# EAGLE design Level-Shifter-74244_v10 (EAGLE 7.7.0)
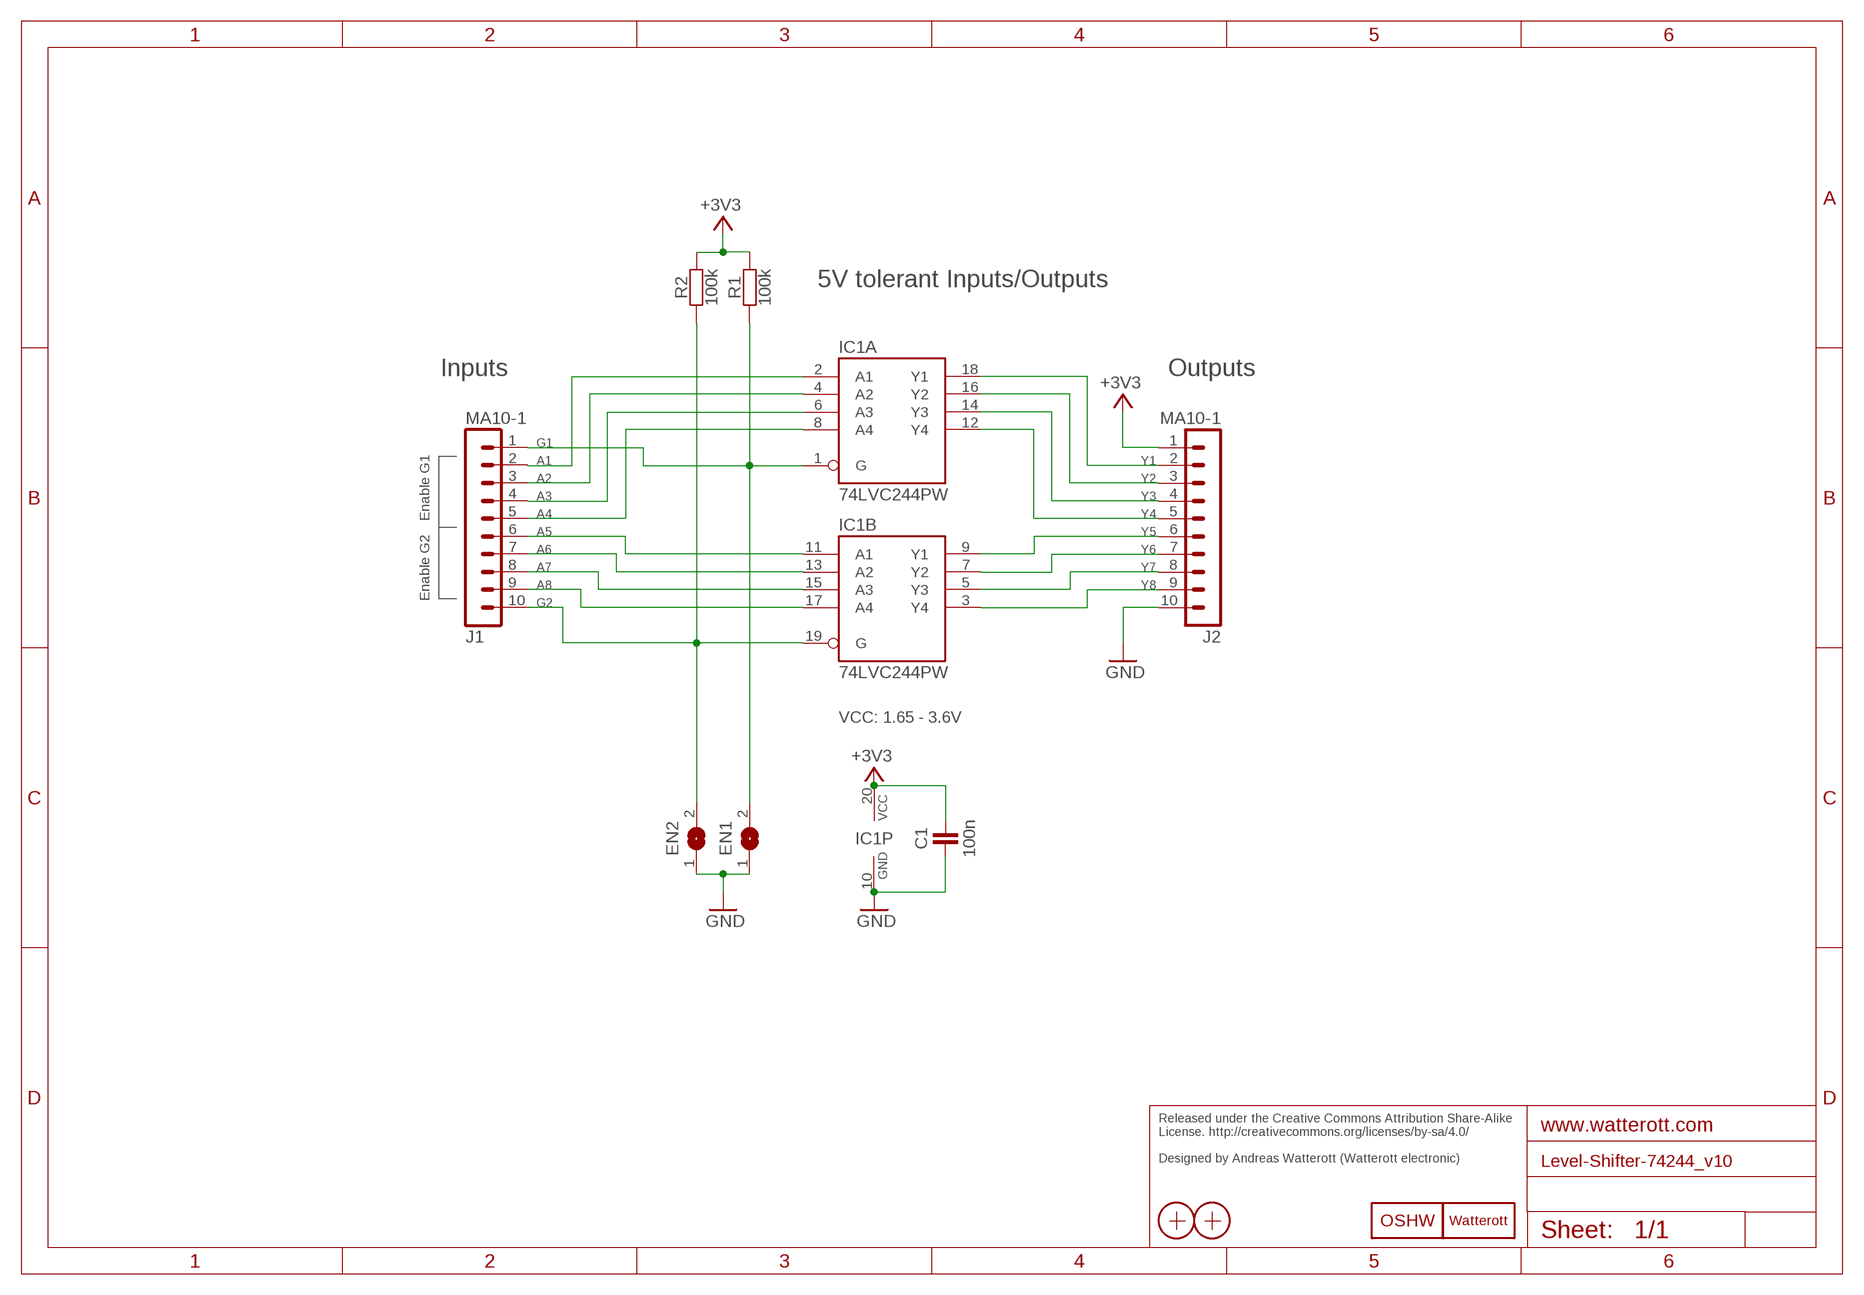
[diagram p0: schematic, sheet 1]

## Parts
C1  100n  CAPACITOR-0402  [C0402]
EN1  JUMPER2-0603-NC  [JUMPER2-0603_NC]
EN2  JUMPER2-0603-NC  [JUMPER2-0603_NC]
IC1  74LVC244PW  [TSSOP20]
J1  MA10-1  [MA10-1]
J2  MA10-1  [MA10-1]
LOGO1  OSHW_LOGOX0070  [OSHW_6X70]
LOGO2  LOGO-S_PLACE_S  [SPARK_TPLACE_S]
R1  100k  RESISTOR-0402  [C0402]
R2  100k  RESISTOR-0402  [C0402]
X1  PASSER-07  [PASSER_07MM]
X2  PASSER-07  [PASSER_07MM]

## Nets
+3V3: C1.2 IC1.20(P:VCC) J2.1 R1.2 R2.2
A1: IC1.2(A:A1) J1.2
A2: IC1.4(A:A2) J1.3
A3: IC1.6(A:A3) J1.4
A4: IC1.8(A:A4) J1.5
A5: IC1.11(B:A1) J1.6
A6: IC1.13(B:A2) J1.7
A7: IC1.15(B:A3) J1.8
A8: IC1.17(B:A4) J1.9
G1: EN1.2 IC1.1(A:G) J1.1 R1.1
G2: EN2.2 IC1.19(B:G) J1.10 R2.1
GND: C1.1 EN1.1 EN2.1 IC1.10(P:GND) J2.10
Y1: IC1.18(A:Y1) J2.2
Y2: IC1.16(A:Y2) J2.3
Y3: IC1.14(A:Y3) J2.4
Y4: IC1.12(A:Y4) J2.5
Y5: IC1.9(B:Y1) J2.6
Y6: IC1.7(B:Y2) J2.7
Y7: IC1.5(B:Y3) J2.8
Y8: IC1.3(B:Y4) J2.9

## Notes on the sheet
- 5V tolerant Inputs/Outputs
- Inputs | Outputs
- Enable G1
- Enable G2
- VCC: 1.65 - 3.6V
- Released under the Creative Commons Attribution Share-Alike 
  License. http://creativecommons.org/licenses/by-sa/4.0/
  
  Designed by Andreas Watterott (Watterott electronic)

## Library data of the parts
C1 = we-rcl:CAPACITOR: Capacitors ...2.2uF @ 6.3V -> 0402 ...4.7uF @ 6.3V -> 0603 ...10uF @ 16V -> 0805 ...22uF @ 25V -> 1206
EN1 EN2 = we-rcl:JUMPER2: 2 Pin Jumpers
IC1 = we-chip:74*244: 74x244 Octal Buffer and Line Driver (3-State); DIGIKEY: 568-1583-2-ND
J1 J2 = we-con:MA10-1: Pin Header
LOGO1 = we-symbol:OSHW_LOGO: Open-Source-Hardware Logo
LOGO2 = we-symbol:LOGO: Watterott electronic Logo
R1 R2 = we-rcl:RESISTOR: Resistors all kinds in 0402 and 0603
X1 X2 = we-symbol:PASSER: Fiducial Markers

## Board
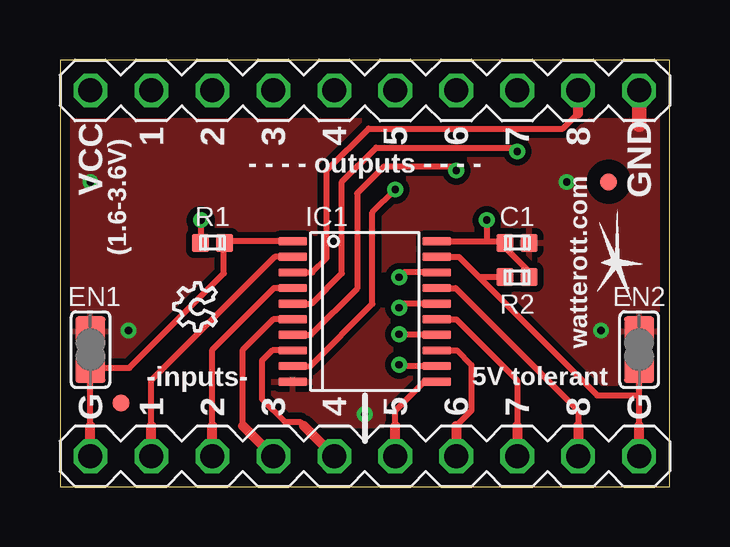
[diagram p1: board, top side]
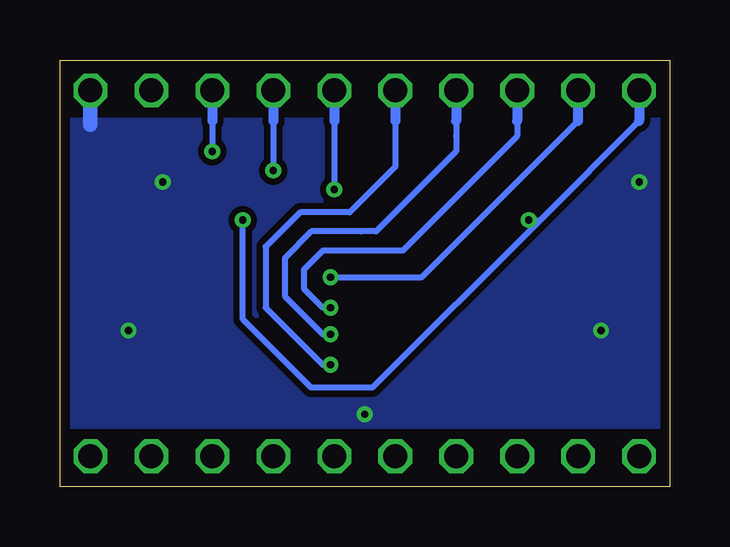
[diagram p2: board, bottom side, seen from below]

Size 25.4 x 17.78 mm. Coordinates in mm from the lower left corner, seen from the top.
Outline: 0,0 25.4,0 25.4,17.78 0,17.78 0,0
Copper layers (1*16): Top 0.035mm / dielectric 1.5mm / Bottom 0.035mm
Design rules "we-dru-2-layer *": minimum track width 0.15mm, minimum drill 0.3mm, track to track 0.15mm, track to pad 0.15mm, pad to pad 0.15mm, via to via 0.15mm, smd to smd 0.1mm, copper to edge 0.4mm, drill to drill 0.2mm, minimum pad ring 0.18mm, minimum via ring 0.18mm, stop-mask expansion 0.1mm, vias tented up to drill 0.5mm, thermal gap 0.25mm

### Footprints (pad centres in the part's own frame; a part is rotated, then mirrored left to right if it is on the bottom)
C0402 = smd 0.75 x 0.7: 1 0,0.5; 2 0,-0.5
JUMPER2-0603_NC = smd 1.25 x 1.25: 1 0,0.76; 2 0,-0.76
TSSOP20 = smd 1.2 x 0.35: 1 -3,2.925; 2 -3,2.275; 3 -3,1.625; 4 -3,0.975; 5 -3,0.325; 6 -3,-0.325; 7 -3,-0.975; 8 -3,-1.625; 9 -3,-2.275; 10 -3,-2.925; 11 3,-2.925; 12 3,-2.275; 13 3,-1.625; 14 3,-0.975; 15 3,-0.325; 16 3,0.325; 17 3,0.975; 18 3,1.625; 19 3,2.275; 20 3,2.925
MA10-1 = drill 1 octagon: 1 0,11.43; 2 0,8.89; 3 0,6.35; 4 0,3.81; 5 0,1.27; 6 0,-1.27; 7 0,-3.81; 8 0,-6.35; 9 0,-8.89; 10 0,-11.43
PASSER_07MM = smd 0.7 x 0.7: X 0,0

### Placement (x,y rotation side)
C1  19.05,10.16 270 top
EN1  1.27,5.71 0 top
EN2  24.13,5.71 0 top
IC1  12.7,7.3 0 top
J1  12.7,1.27 90 top
J2  12.7,16.51 90 top
LOGO1  6.51,6.51 90 top
LOGO2  23.18,9.37 90 top
R1  6.35,10.16 270 top
R2  19.05,8.73 90 top
X1  2.54,3.49 0 top
X2  22.86,12.7 0 top

### Tracks (layer width: path | path; a pad name or v marks a point on that pad's centre or on a via)
+3V3  (via drill 0.3)
  Top 0.254: IC1.20 17.78,10.23 | 17.78,10.23 18.48,10.23 C1.2 18.55,9.96 19.55,8.96 R2.2 | v17.78,11.11 17.78,10.23 | v5.87,11.11 5.87,10.18 R1.2
  Bottom 0.254: 1.27,15.24 5.4,11.11 | 5.4,11.11 12.38,4.13 14.92,4.13 17.78,6.99 v17.78,11.11 | v5.87,11.11 5.4,11.11
  Bottom 0.406: J2.1 1.27,15.24
A1
  Top 0.254: 3.81,2.54 3.81,4.45 8.94,9.58 IC1.2
  Top 0.406: J1.2 3.81,2.54
A2
  Top 0.254: 6.35,2.54 6.35,5.71 8.91,8.28 IC1.4
  Top 0.406: J1.3 6.35,2.54
A3
  Top 0.254: 7.62,2.54 7.62,5.71 8.88,6.98 IC1.6
  Top 0.406: J1.4 7.62,2.54
A4
  Top 0.254: IC1.8 8.85,5.68 8.41,5.24 8.41,3.65 9.37,2.7 10,2.7 10.16,2.54
  Top 0.406: 10.16,2.54 J1.5
A5
  Top 0.254: 13.97,2.54 13.97,3.17 15.17,4.38 IC1.11
  Top 0.406: J1.6 13.97,2.54
A6
  Top 0.254: IC1.13 16.55,5.68 17.14,5.08 17.14,3.17 16.51,2.54
  Top 0.406: 16.51,2.54 J1.7
A7
  Top 0.254: IC1.15 16.52,6.98 19.05,4.45 19.05,2.54
  Top 0.406: 19.05,2.54 J1.8
A8
  Top 0.254: IC1.17 16.49,8.28 21.59,3.17 21.59,2.54
  Top 0.406: 21.59,2.54 J1.9
G1
  Top 0.254: IC1.1 6.92,10.23 R1.1 6.83,10.14 6.83,8.89 2.89,4.96 EN1.2 1.27,2.54
  Top 0.406: J1.1 1.27,2.54
G2
  Top 0.254: IC1.19 16.62,9.58 17.46,8.73 | 24.13,2.54 24.13,3.81 | 24.13,3.81 EN2.2 | 17.46,8.73 22.38,3.81 24.13,3.81 | R2.1 17.46,8.73
  Top 0.406: J1.10 24.13,2.54
GND  (via drill 0.3)
  Top 0.61: J2.10 24.13,15.08
  Bottom 0.61: 24.13,15.08 J2.10
  other vias: 2.86,6.51 12.7,3.02 22.54,6.51 21.11,12.7 1.27,12.7
  pour Bottom (isolate 0.254): 0,15.24 25.4,15.24 25.4,2.54 0,2.54
  pour Top (isolate 0.254): 0,15.24 25.4,15.24 25.4,2.54 0,2.54
Y1  (via drill 0.3)
  Top 0.254: IC1.18 14.32,8.93 v14.13,8.73
  Bottom 0.254: v14.13,8.73 10.32,8.73 3.81,15.24
  Bottom 0.406: 3.81,15.24 J2.2
Y2  (via drill 0.3)
  Top 0.254: v14.13,7.46 14.29,7.63 IC1.16
  Bottom 0.254: 6.35,15.24 6.35,14.61 11.11,9.84 11.75,9.84 14.45,9.84 15.24,9.05 15.24,8.26 14.45,7.46 v14.13,7.46
  Bottom 0.406: J2.3 6.35,15.24
Y3  (via drill 0.3)
  Top 0.254: IC1.14 14.15,6.33 v14.13,6.35
  Bottom 0.254: 8.89,15.24 8.89,14.61 8.89,13.97 12.22,10.64 12.86,10.64 14.92,10.64 16.03,9.53 16.03,7.94 14.45,6.35 v14.13,6.35
  Bottom 0.406: J2.4 8.89,15.24
Y4  (via drill 0.3)
  Top 0.254: IC1.12 14.18,5.03 v14.13,5.08
  Bottom 0.254: 11.43,15.24 11.43,13.34 13.34,11.43 15.4,11.43 16.83,10 16.83,7.46 14.45,5.08 v14.13,5.08
  Bottom 0.406: J2.5 11.43,15.24
Y5  (via drill 0.3)
  Top 0.254: IC1.9 10.43,5.03 13.02,7.62 13.02,11.43 v13.97,12.38
  Bottom 0.254: 13.97,15.24 v13.97,12.38
  Bottom 0.406: J2.6 13.97,15.24
Y6  (via drill 0.3)
  Top 0.254: v16.51,13.18 16.35,13.34 13.49,13.34 12.38,12.22 12.38,8.26 10.46,6.33 IC1.7
  Bottom 0.254: 16.51,15.24 v16.51,13.18
  Bottom 0.406: J2.7 16.51,15.24
Y7  (via drill 0.3)
  Top 0.254: IC1.5 10.48,7.63 11.75,8.89 11.75,12.7 13.18,14.13 18.89,14.13 v19.05,13.97
  Bottom 0.254: 19.05,15.24 v19.05,13.97
  Bottom 0.406: J2.8 19.05,15.24
Y8
  Top 0.254: IC1.3 10.52,8.93 11.11,9.53 11.11,13.18 12.86,14.92 20.95,14.92 21.59,15.56
  Top 0.406: 21.59,15.56 J2.9

### Text on the board
tPlace: 1 | 2 | 3 | 4 | 5 | 6 | 7 | 8 | VCC | GND | - - - - outputs - - - - | (1.6-3.6V) | watterott.com | -inputs- | 5V tolerant | G | 1 | 2 | 3 | 4 | 5 | 6 | 7 | 8 | G
Reference: Silkscreen: 21 tPlace